# EAGLE schematic M_C_ext_main_cp2102N (EAGLE 9.6.2)
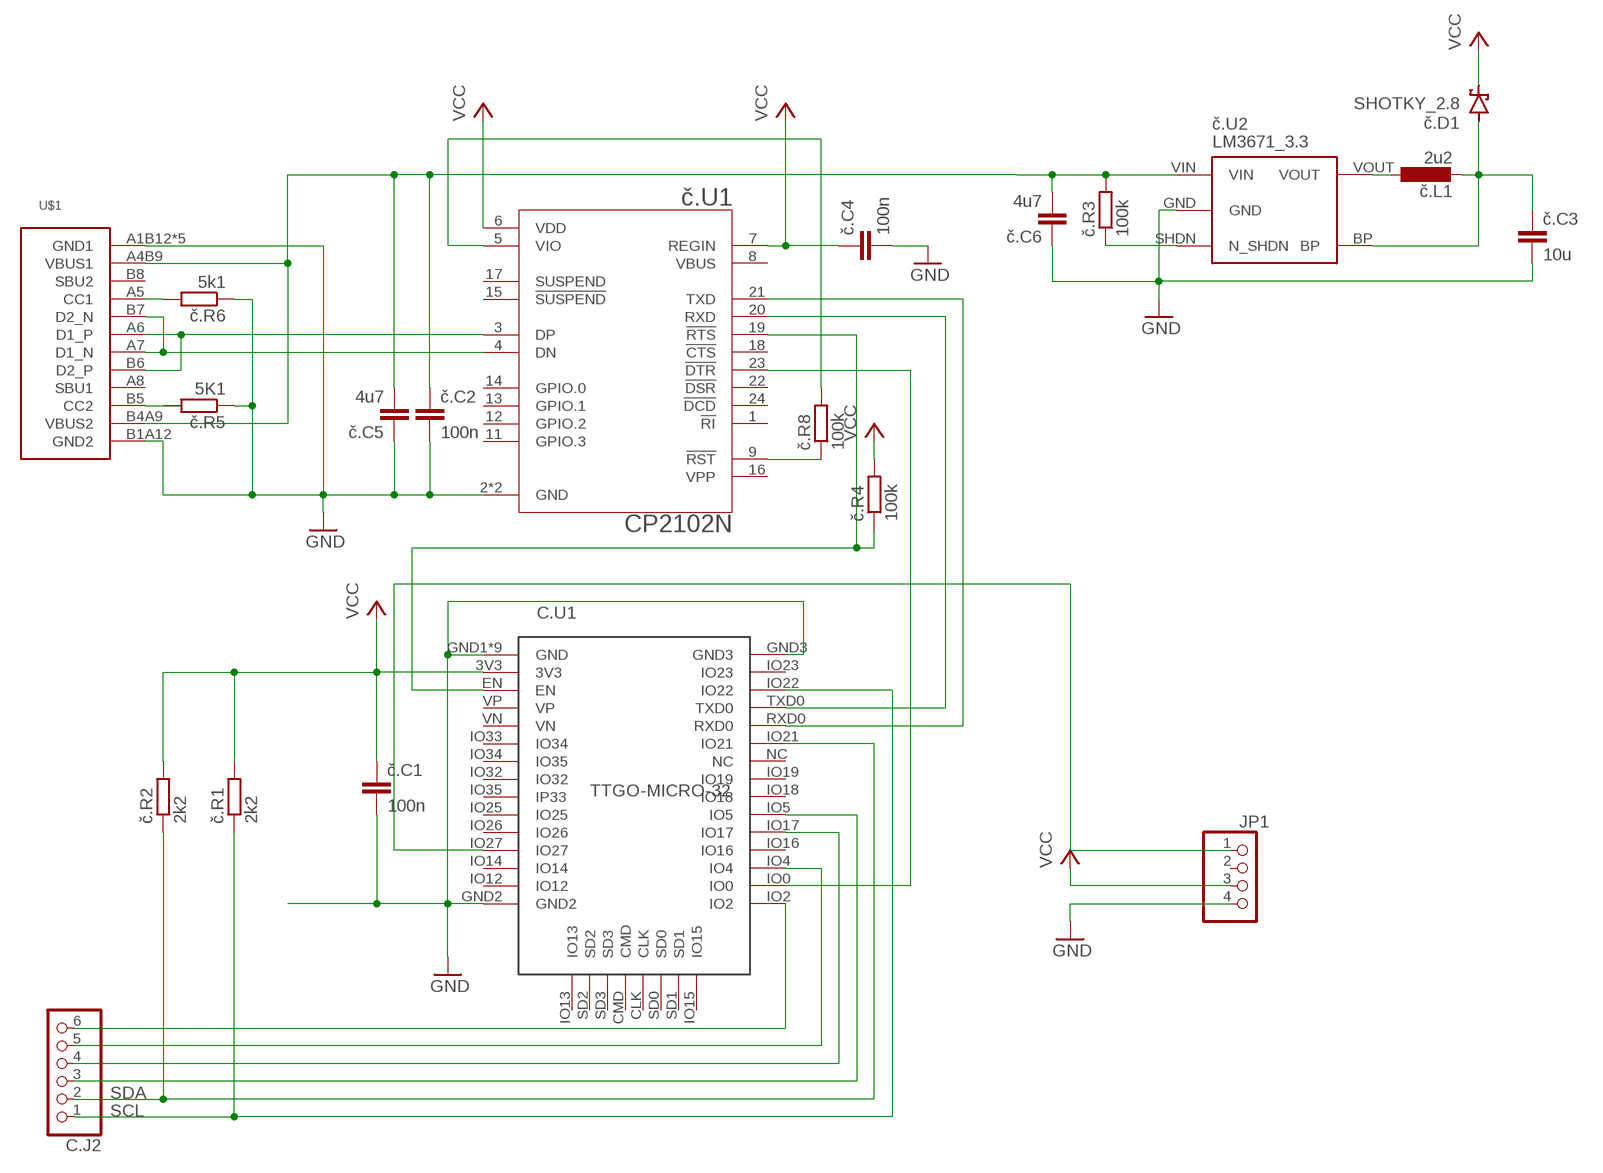
[diagram p0: schematic, sheet 1]

## Parts
C.J2  PINHD-1X6  [1X06]
C.U1  TTGO-MICRO-32  [TTGO-MICRO-32]
JP1  PINHD-1X4  [1X04]
U$1  USB-C  [USB-C]
č.C1  100n  C-EUC0603  [C0603]
č.C2  100n  C-EUC0603  [C0603]
č.C3  10u  C-EUC0805  [C0805]
č.C4  100n  C-EUC0603  [C0603]
č.C5  4u7  C-EUC0603  [C0603]
č.C6  4u7  C-EUC0603  [C0603]
č.D1  SHOTKY_2.8  [SHOTKY_2.8]
č.L1  2u2  L-EUL3230M  [L3230M]
č.R1  2k2  R-EU_R0603  [R0603]
č.R2  2k2  R-EU_R0603  [R0603]
č.R3  100k  R-EU_R0603  [R0603]
č.R4  100k  R-EU_R0603  [R0603]
č.R5  5K1  R-EU_R0603  [R0603]
č.R6  5k1  R-EU_R0603  [R0603]
č.R8  100k  R-EU_R0603  [R0603]
č.U1  CP2102N  CP2104-F03-GM  [QFN50P400X400X80-25N]
č.U2  LM3671_3.3  STABILISER_APE8865  [SOT32-5]

## Nets
GND: C.U1.GND1(GND) C.U1.GND2 C.U1.GND3 C.U1.GND4(GND) C.U1.GND5(GND) C.U1.GND6(GND) C.U1.GND7(GND) C.U1.GND8(GND) C.U1.GND9(GND) C.U1.GND10(GND) C.U1.GND11(GND) JP1.4 U$1.A1B12(GND1) U$1.B1A12(GND2) U$1.SH1(GND1) U$1.SH2(GND1) U$1.SH3(GND1) U$1.SH4(GND1) č.C1.2 č.C2.2 č.C3.2 č.C4.2 č.C5.1 č.C6.1 č.R5.1 č.R6.1 č.U1.2(GND) č.U1.25(GND) č.U2.GND
N$1: U$1.A7(D1_N) U$1.B7(D2_N) č.U1.4(DN)
N$2: U$1.A6(D1_P) U$1.B6(D2_P) č.U1.3(DP)
N$3: U$1.A5(CC1) č.R6.2
N$4: U$1.B5(CC2) č.R5.2
N$5: č.C3.1 č.D1.A č.L1.2 č.U2.BP
N$6: C.J2.6 C.U1.IO2
N$7: C.U1.IO27 JP1.1
N$8: č.R8.2 č.U1.5(VIO)
N$10: č.L1.1 č.U2.VOUT
N$11: č.R3.1 č.U2.SHDN(N_SHDN)
N$12: C.J2.5 C.U1.IO4
N$13: C.J2.4 C.U1.IO17
N$14: C.J2.3 C.U1.IO5
N$16: č.R8.1 č.U1.9(!RST!)
PROG: C.U1.IO0 č.U1.23(!DTR)
RESET: C.U1.EN č.R4.1 č.U1.19(!RTS)
RX: C.U1.TXD0 č.U1.20(RXD)
SCL: C.J2.1 C.U1.IO22 č.R1.1
SDA: C.J2.2 C.U1.IO21 č.R2.1
TX: C.U1.RXD0 č.U1.21(TXD)
VCC: C.U1.3V3 JP1.3 č.C1.1 č.C4.1 č.D1.K(C) č.R1.2 č.R2.2 č.R4.2 č.U1.6(VDD) č.U1.7(REGIN)
VUSB: U$1.A4B9(VBUS1) U$1.B4A9(VBUS2) č.C2.1 č.C5.2 č.C6.2 č.R3.2 č.U2.VIN
Unconnected: C.U1.CLK C.U1.CMD C.U1.IO12 C.U1.IO13 C.U1.IO14 C.U1.IO15 C.U1.IO16 C.U1.IO18 C.U1.IO19 C.U1.IO23 C.U1.IO25 C.U1.IO26 C.U1.IO32 C.U1.IO33(IO34) C.U1.IO34(IO35) C.U1.IO35(IP33) C.U1.NC C.U1.SD0 C.U1.SD1 C.U1.SD2 C.U1.SD3 C.U1.VN C.U1.VP JP1.2 U$1.A8(SBU1) U$1.B8(SBU2) č.U1.1(!RI) č.U1.8(VBUS) č.U1.11(GPIO.3) č.U1.12(GPIO.2) č.U1.13(GPIO.1) č.U1.14(GPIO.0) č.U1.15(!SUSPEND!) č.U1.16(VPP) č.U1.17(SUSPEND) č.U1.18(!CTS) č.U1.22(!DSR) č.U1.24(!DCD)

## Library data of the parts
C.J2 = pinhead2:PINHD-1X6: PIN HEADER
C.U1 = hugo:TTGO-MICRO-32
JP1 = pinhead2:PINHD-1X4: PIN HEADER
U$1 = hugo:USB-C
č.C1-č.C6 = rcl:C-EU: CAPACITOR, European symbol; SPICEPREFIX: C
č.D1 = hugo:SHOTKY_2.8
č.L1 = rcl:L-EU: INDUCTOR, European symbol; SPICEPREFIX: L
č.R1-č.R6 č.R8 = rcl:R-EU_: RESISTOR, European symbol; SPICEPREFIX: R
č.U1 = CP2104:CP2104: Silabs CP2104 USB to UART Bridge; AVAILABILITY: Unavailable; DESCRIPTION: USB Bridge, USB to UART USB 2.0 UART Interface 24-QFN (4x4); MF: Silicon Labs; MP: CP2104; PACKAGE: QFN-24 Silicon Labs; PRICE: None
č.U2 = !stavebnice03:STABILISER_APE8865